# EAGLE design Wio - Expansion Board (EAGLE 9.6.2)
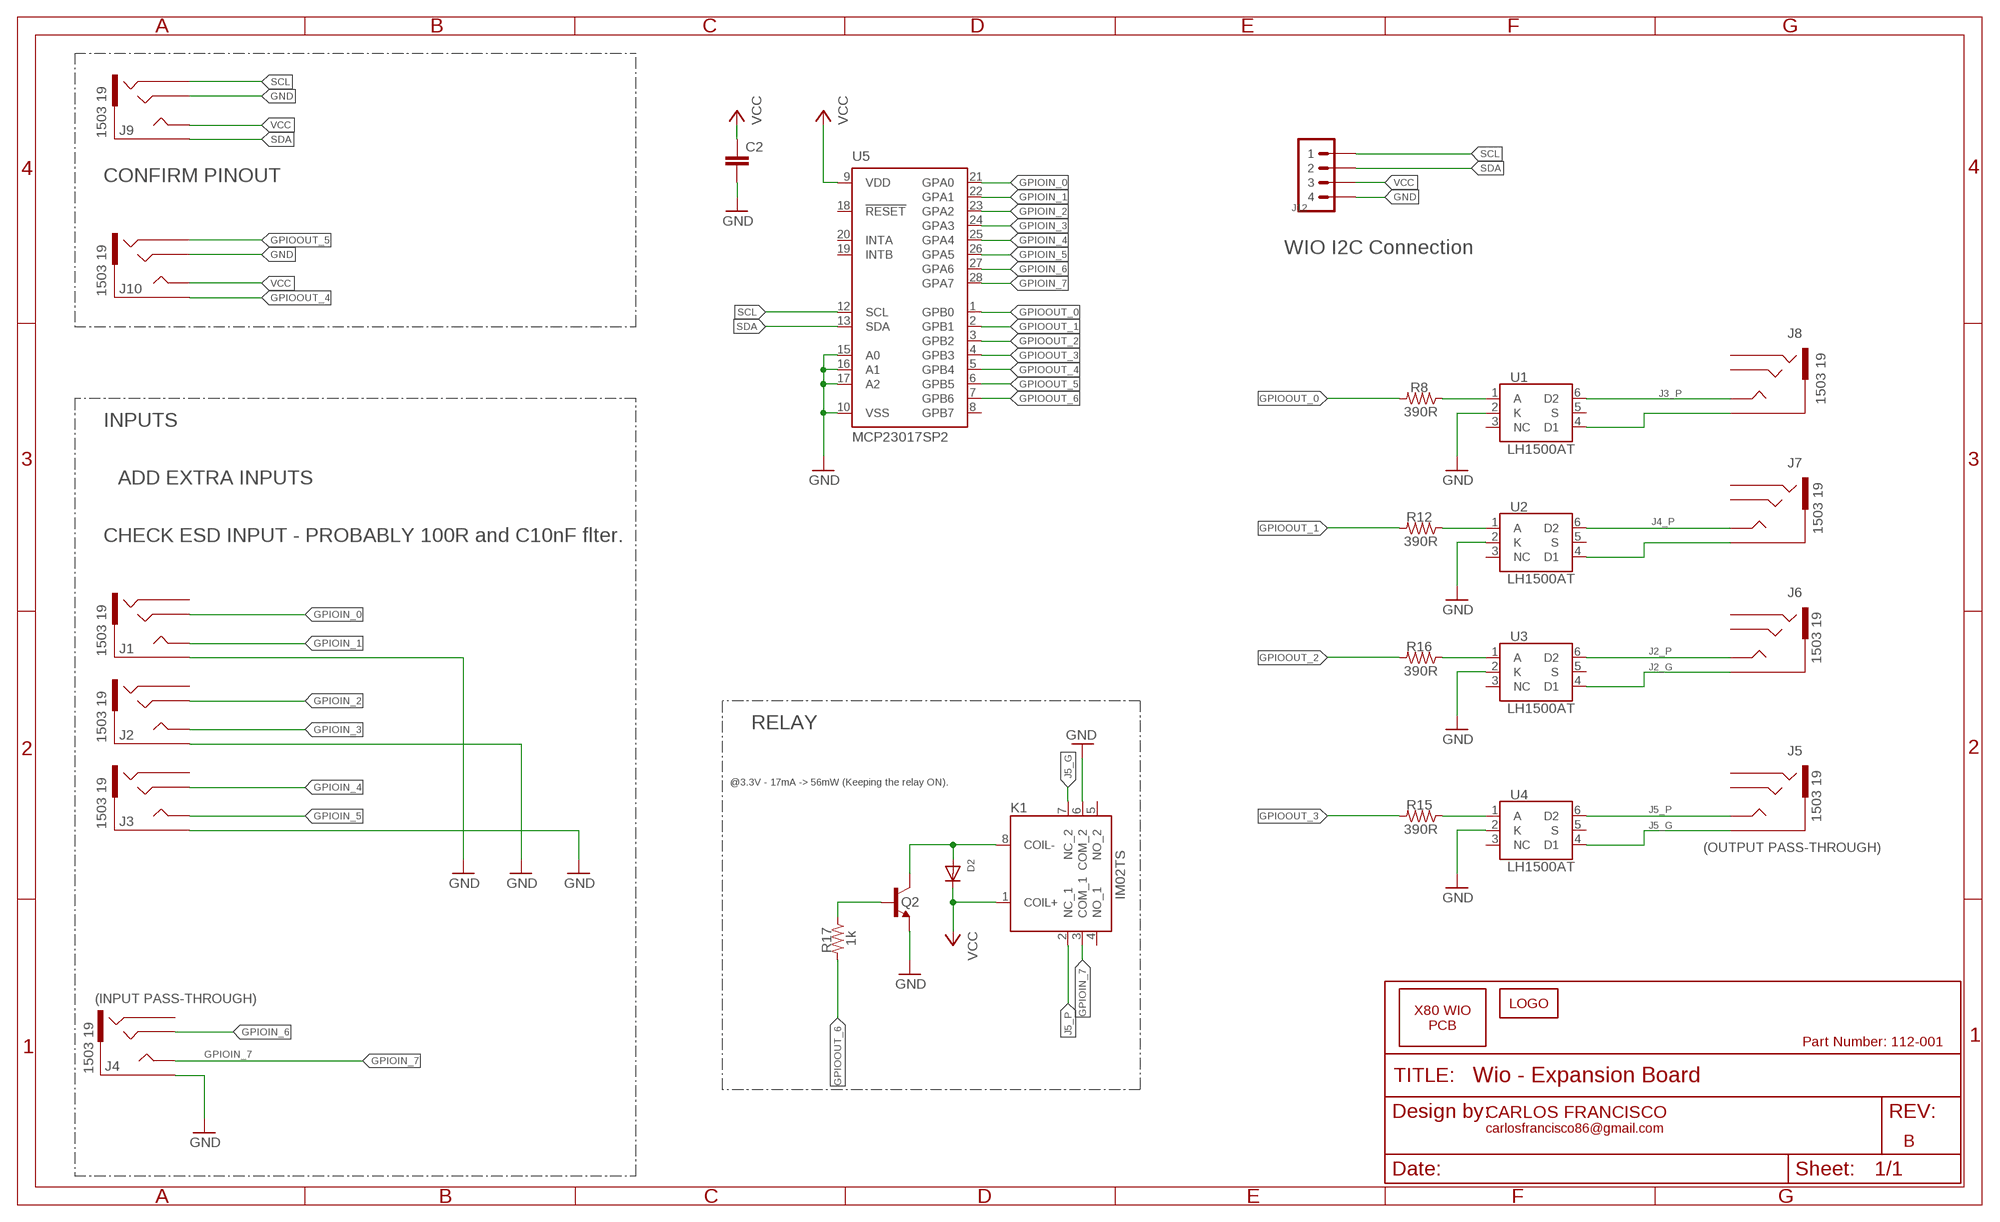
[diagram p0: schematic, sheet 1]

## Parts
C2  C-EU025-025X050  [C025-025X050]
D2  1N4148  DIODE-DO-35  [DO-1N4148]
J1  1503 19  STEREO_JACK-1503-19  [1503-19]
J2  1503 19  STEREO_JACK-1503-19  [1503-19]
J3  1503 19  STEREO_JACK-1503-19  [1503-19]
J4  1503 19  STEREO_JACK-1503-19  [1503-19]
J5  1503 19  STEREO_JACK-1503-19  [1503-19]
J6  1503 19  STEREO_JACK-1503-19  [1503-19]
J7  1503 19  STEREO_JACK-1503-19  [1503-19]
J8  1503 19  STEREO_JACK-1503-19  [1503-19]
J9  1503 19  STEREO_JACK-1503-19  [1503-19]
J10  1503 19  STEREO_JACK-1503-19  [1503-19]
J12  4P-2.0-90D  CONN_04-GROOVE-RA-THT  [HW4-2.0-90D]
K1  IM02TS  IM02TS  [IM03TS114620378]
LOGO1  LOGO-10MM  [LOGO_10MM]
PCB2  X80_WIO_PCB-WIO_PCB_V1  [WIO_PCB]
Q2  PN2222A  NPN-TO-92  [TO92-EBC-OVAL]
R8  390R  R-0206-THT-RS  [0204/7]
R12  390R  R-0206-THT-RS  [0204/7]
R15  390R  R-0206-THT-RS  [0204/7]
R16  390R  R-0206-THT-RS  [0204/7]
R17  1k  R-0206-THT-RS  [0204/7]
U1  LH1500AT  SSR-LH1500AT  [DIP762W47P254L880H410Q6N]
U2  LH1500AT  SSR-LH1500AT  [DIP762W47P254L880H410Q6N]
U3  LH1500AT  SSR-LH1500AT  [DIP762W47P254L880H410Q6N]
U4  LH1500AT  SSR-LH1500AT  [DIP762W47P254L880H410Q6N]
U5  MCP23017SP2  [DIL28-3-ROUND]

## Nets
GND: C2.2 J1.1 J2.1 J3.1 J4.1 J9.3 J10.3 J12.4 K1.6(COM_2) Q2.E U1.2(K) U2.2(K) U3.2(K) U4.2(K) U5.10(VSS) U5.15(A0) U5.16(A1) U5.17(A2)
GPIOIN_0: J1.3 U5.21(GPA0)
GPIOIN_1: J1.4 J1.5 U5.22(GPA1)
GPIOIN_2: J2.3 U5.23(GPA2)
GPIOIN_3: J2.4 J2.5 U5.24(GPA3)
GPIOIN_4: J3.3 U5.25(GPA4)
GPIOIN_5: J3.4 J3.5 U5.26(GPA5)
GPIOIN_6: J4.3 U5.27(GPA6)
GPIOIN_7: J4.4 J4.5 K1.3(COM_1) U5.28(GPA7)
GPIOOUT_0: R8.1 U5.1(GPB0)
GPIOOUT_1: R12.1 U5.2(GPB1)
GPIOOUT_2: R16.1 U5.3(GPB2)
GPIOOUT_3: R15.1 U5.4(GPB3)
GPIOOUT_4: J10.1 U5.5(GPB4)
GPIOOUT_5: J10.2 U5.6(GPB5)
GPIOOUT_6: R17.1 U5.7(GPB6)
J2_G: J6.1 U3.4(D1)
J2_P: J6.4 J6.5 U3.6(D2)
J3_P: J8.4 J8.5 U1.6(D2)
J4_P: J7.4 J7.5 U2.6(D2)
J5_G: J5.1 K1.7(NC_2) U4.4(D1)
J5_P: J5.4 J5.5 K1.2(NC_1) U4.6(D2)
N$2: J8.1 U1.4(D1)
N$3: J7.1 U2.4(D1)
N$6: R8.2 U1.1(A)
N$8: R12.2 U2.1(A)
N$9: R16.2 U3.1(A)
N$10: R15.2 U4.1(A)
N$14: D2.A K1.8(COIL-) Q2.C
N$19: Q2.B R17.2
SCL: J9.2 J12.1 U5.12(SCL)
SDA: J9.1 J12.2 U5.13(SDA)
VCC: C2.1 D2.C J9.4 J9.5 J10.4 J10.5 J12.3 K1.1(COIL+) U5.9(VDD)
Unconnected: J1.2 J2.2 J3.2 J4.2 J5.2 J5.3 J6.2 J6.3 J7.2 J7.3 J8.2 J8.3 K1.4(NO_1) K1.5(NO_2) U1.3(NC) U1.5(S) U2.3(NC) U2.5(S) U3.3(NC) U3.5(S) U4.3(NC) U4.5(S) U5.8(GPB7) U5.18(!RESET) U5.19(INTB) U5.20(INTA)

## Notes on the sheet
- CONFIRM PINOUT
- WIO I2C Connection
- INPUTS
- ADD EXTRA INPUTS
- CHECK ESD INPUT - PROBABLY 100R and C10nF flter.
- RELAY
- @3.3V - 17mA -> 56mW (Keeping the relay ON).
- (OUTPUT PASS-THROUGH)
- (INPUT PASS-THROUGH)
- Part Number: 112-001
- CARLOS FRANCISCO
- carlosfrancisco86@gmail.com
- B

## Library data of the parts
C2 = rcl:C-EU: CAPACITOR, European symbol; SPICEPREFIX: C
D2 = AceCenter:DIODE: General purpose diode; DESCRIPTION: Switching Diode, 400mA 100V, 2-Pin DO-35; MFR: ON Semiconductor; MFR_NUM: 1N4148TR; VENDOR_NUM: 671-5477
J1-J10 = AceCenter:STEREO_JACK: 3.5 mm PCB Mount Stereo Jack Socket; DESCRIPTION: Lumberg 3.5 mm PCB Mount Stereo Jack Socket, 4Pole 1A; MFR: Lumberg; MFR_NUM: 1503 19; VENDOR: RS-ONLINE; VENDOR_NUM: 124-8885
J12 = AceCenter:CONN_04
K1 = AceCenter:IM02TS: DPDT telecom PCB relay, 2A 5Vdc coil, EA Source: Datasheet <http://uk.rs-online.com/web/p/products/4227029>; DESCRIPTION: DPDT telecom PCB relay, 2A 5Vdc coil, EA; MFR: TE Connectivity; MFR_NUM: IM02TS; VENDOR: RS-ONLINE; VENDOR_NUM: 422-7013
LOGO1 = AceCenter:LOGO
PCB2 = AceCenter:X80_WIO_PCB
Q2 = AceCenter:NPN; DESCRIPTION: NPN General-Purpose Amplifier; MFR: ON Semiconductor; MFR_NUM: PN2222ABU; VENDOR: RS-ONLINE; VENDOR_NUM: 739-0555
R8 R12 R15-R17 = AceCenter:R: SMD Resistor
U1-U4 = AceCenter:SSR: Vishay 1 Form A Solid-State Relay (Normally Open); DESCRIPTION: 1 Form A Solid-State Relay (NO); MFR: Vishay; MFR_NUM: LH1500AT; VENDOR: RS-ONLINE; VENDOR_NUM: 180-8794
U5 = AceCenter:MCP23017: http://ww1.microchip.com/downloads/en/DeviceDoc/21952a.pdf Source: http://ww1.microchip.com/downloads/en/DeviceDoc/21952a.pdf

## Board
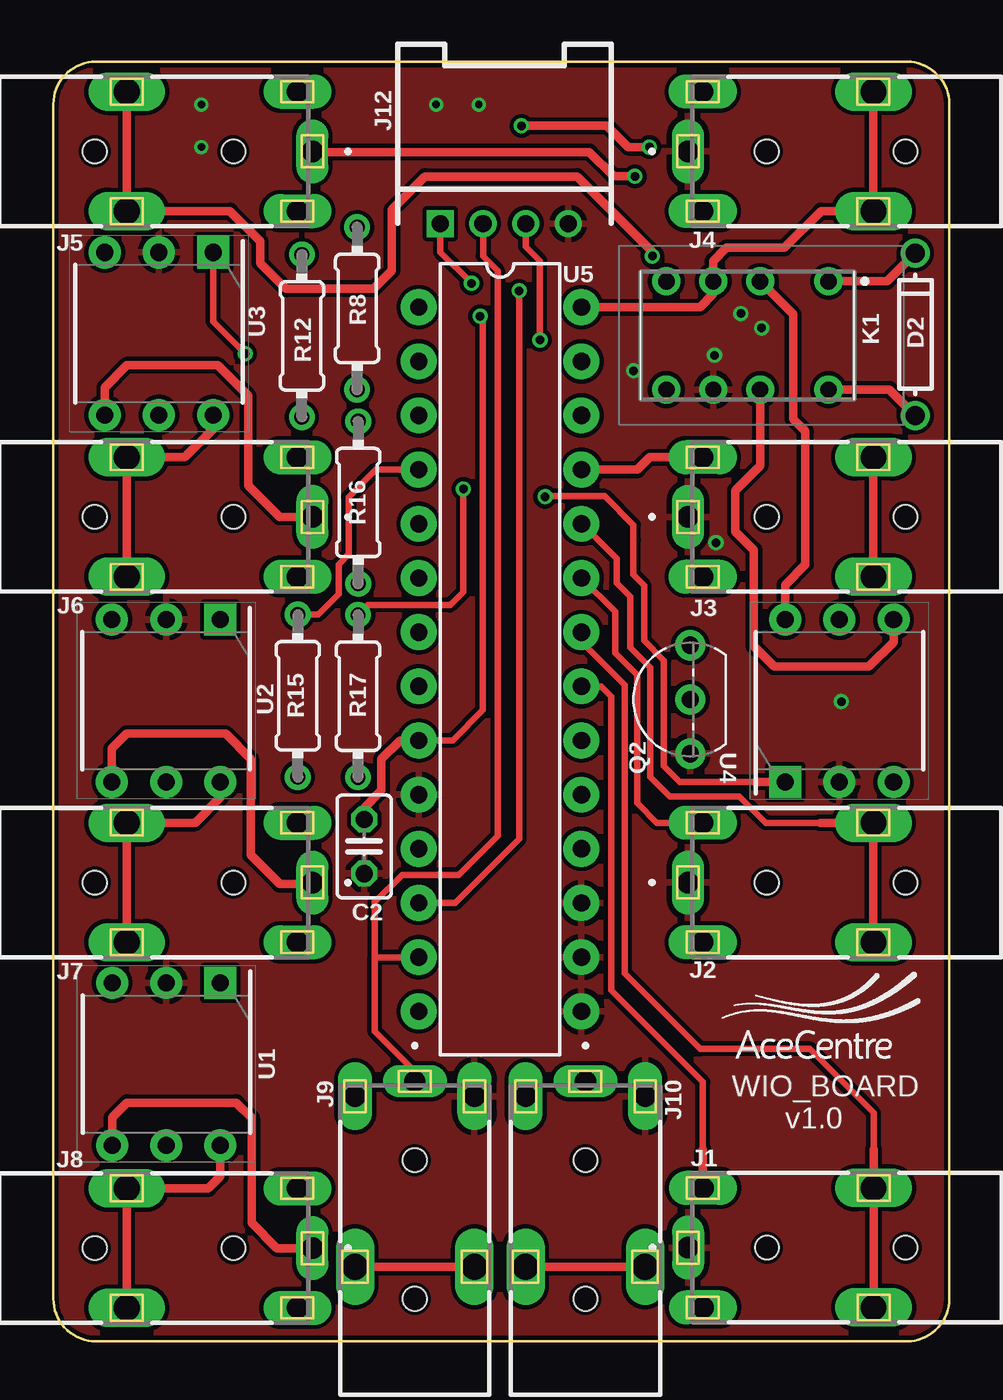
[diagram p1: board, top side]
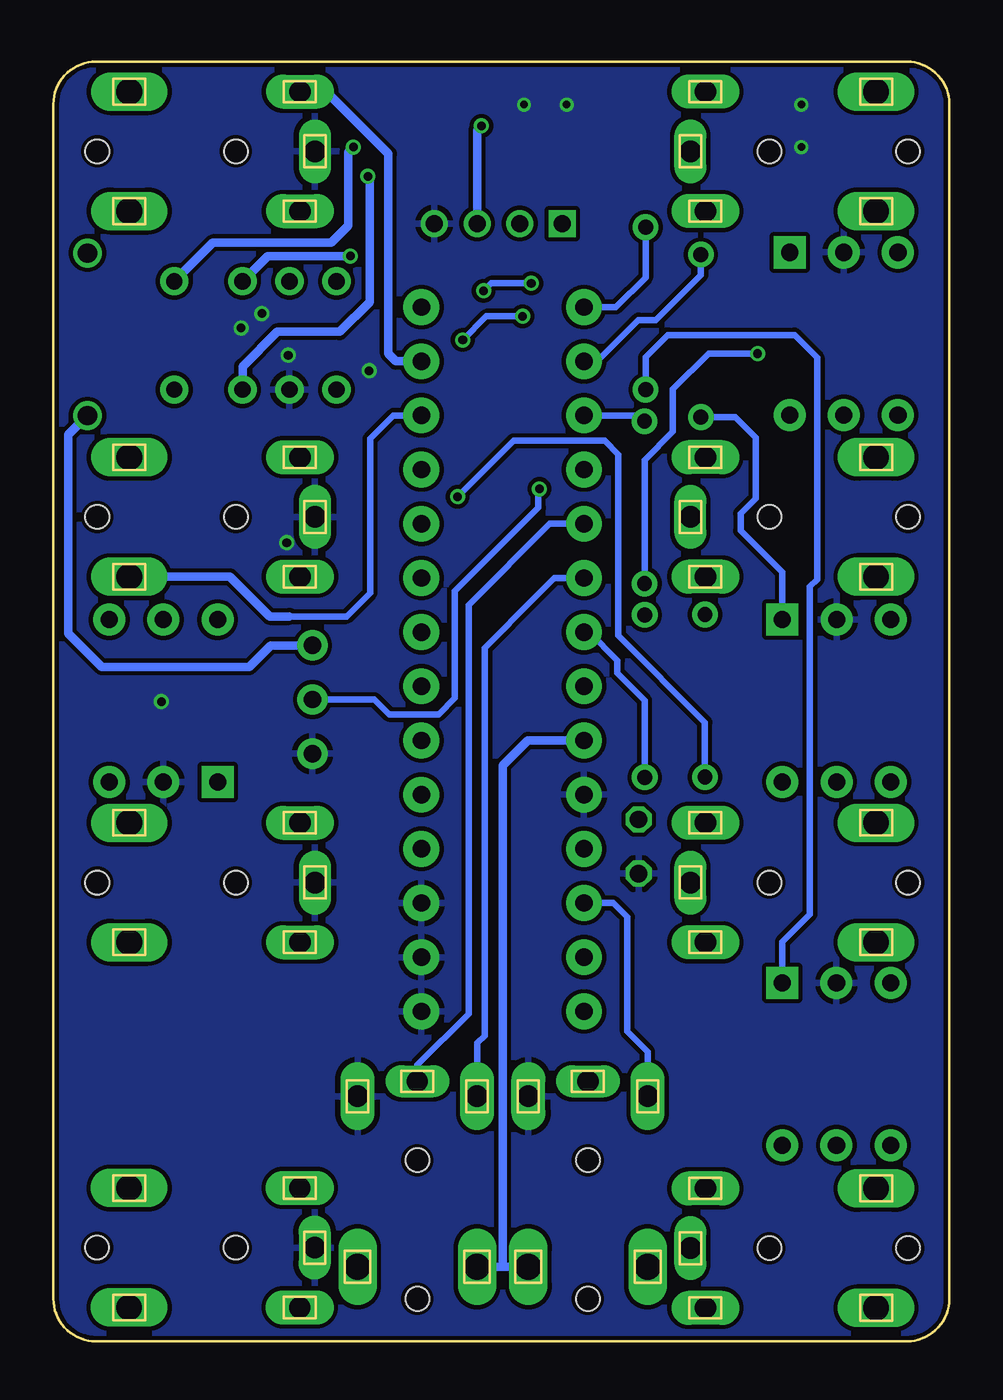
[diagram p2: board, bottom side, seen from below]

Size 42 x 60 mm. Coordinates in mm from the lower left corner, seen from the top.
Copper layers (1*16): Top 0.035mm / dielectric 1.5mm / Bottom 0.035mm
Design rules "SparkFun-2-layer-PCBWay-LIMIT": minimum track width 6mil, minimum drill 0.3mm, track to track 6mil, track to pad 6mil, pad to pad 6mil, via to via 6mil, smd to smd 6mil, copper to edge 6mil, drill to drill 6mil, minimum pad ring 6mil, minimum via ring 6mil, stop-mask expansion 4mil, vias tented up to drill 25mil, thermal gap 10mil

### Footprints (pad centres in the part's own frame; a part is rotated, then mirrored left to right if it is on the bottom)
C025-025X050 = drill 0.813 octagon: 1 -1.27,0; 2 1.27,0
DO-1N4148 = drill 0.9: A -3.81,0; C 3.81,0
1503-19 = drill 1 pad 1.5 long: 1 14.7,0 | drill 1 pad 1.6 long: 2 14,2.8; 3 14,-2.8 | drill 1.2 pad 1.8 long: 4 6,2.8; 5 6,-2.8 | hole 1.1: 4.5,0; 11,0
HW4-2.0-90D = drill 0.8 pad 1.27 square: 1 -3,0 | drill 0.8 pad 1.27: 2 -1,0; 3 1,0; 4 3,0
IM03TS114620378 = drill 0.77 pad 1.32: 1 0,0; 2 3.2,0; 3 5.4,0; 4 7.6,0; 5 7.6,5.08; 6 5.4,5.08; 7 3.2,5.08; 8 0,5.08
TO92-EBC-OVAL = drill 0.813 pad 1.422: B 0,-1.27; C 2.54,-1.27; E -2.54,-1.27
0204/7 = drill 0.7 pad 1.2: 1 -3.81,0; 2 3.81,0
DIP762W47P254L880H410Q6N = drill 0.8 pad 1.5 square: 1 -3.81,2.54 | drill 0.8 pad 1.5: 2 -3.81,0; 3 -3.81,-2.54; 4 3.81,-2.54; 5 3.81,0; 6 3.81,2.54
DIL28-3-ROUND = drill 0.813 pad 1.676: 1 -16.51,-3.81; 2 -13.97,-3.81; 3 -11.43,-3.81; 4 -8.89,-3.81; 5 -6.35,-3.81; 6 -3.81,-3.81; 7 -1.27,-3.81; 8 1.27,-3.81; 9 3.81,-3.81; 10 6.35,-3.81; 11 8.89,-3.81; 12 11.43,-3.81; 13 13.97,-3.81; 14 16.51,-3.81; 15 16.51,3.81; 16 13.97,3.81; 17 11.43,3.81; 18 8.89,3.81; 19 6.35,3.81; 20 3.81,3.81; 21 1.27,3.81; 22 -1.27,3.81; 23 -3.81,3.81; 24 -6.35,3.81; 25 -8.89,3.81; 26 -11.43,3.81; 27 -13.97,3.81; 28 -16.51,3.81

### Placement (x,y rotation side)
C2  14.57,23.2 270 top
D2  40.4,47.22 90 top
J1  44.45,4.39 180 top
J2  44.44,21.51 180 top
J3  44.44,38.65 180 top
J4  44.44,55.79 180 top
J5  -2.56,55.79 0 top
J6  -2.56,38.65 0 top
J7  -2.56,21.51 0 top
J8  -2.56,4.37 0 top
J9  16.94,-2.51 90 top
J10  24.94,-2.51 90 top
J12  21.14,52.41 0 top
K1  36.33,49.7 180 top
LOGO1  31.31,13.19 0 top
PCB2  0,0 0 top
Q2  28.59,30.09 90 top
R8  14.24,48.43 270 top
R12  11.65,47.14 270 top
R15  11.46,30.26 270 top
R16  14.29,39.33 270 top
R17  14.28,30.25 90 top
U1  5.29,13 270 top
U2  5.29,30.04 270 top
U3  4.95,47.25 270 top
U4  36.84,30.03 90 top
U5  20.94,31.98 270 top

### Tracks (layer width: path | path; a pad name or v marks a point on that pad's centre or on a via)
GND  (via drill 0.35, 0.4)
  other vias: 31.06,37.44 27.2,45.51 36.94,29.99 33.2,47.51 30.99,46.23 32.23,48.19 17.94,57.99 19.94,57.99 6.94,57.99 6.94,55.99
  pour Bottom (isolate 0.2): -0.06,57.99 -0.06,-0.32 39.2,-0.32 arc90 42.2,2.68 42.2,57.62 arc90 39.81,60.01 1.96,60.01 arc90
  pour Top (isolate 0.2): 42.2,57.6 42.2,-0.32 1.25,-0.32 arc-90 -0.06,0.99 -0.06,56.99 arc-90 2.99,60.04 39.76,60.04 arc-90
GPIOIN_0
  Top 0.3: 30.45,8.99 30.45,12.16 26.16,16.45 26.16,30.24 25.69,30.71 U5.21
  Top 0.4: J1.3 30.45,8.99
GPIOIN_1
  Top 0.3: 38.45,8.99 38.45,10.71 35.46,13.7 30.32,13.7 26.78,17.24 26.78,30.78 24.75,32.81 U5.22
  Top 0.4: J1.4 J1.5 38.45,8.99
GPIOIN_2
  Top 0.3: U5.23 26.34,34.21 26.34,32.27 27.36,31.24 27.36,25.23 28.28,24.31 J2.3
GPIOIN_3
  Top 0.3: 35.94,24.31 33.39,24.31 32.16,25.54 28.89,25.54 27.98,26.45 27.98,31.6 27.04,32.54 27.04,34.91 26.4,35.55 26.4,36.7 24.77,38.33 U5.24
  Top 0.4: J2.4 J2.5 35.94,24.31
GPIOIN_4
  Top 0.4: U5.25 27.38,40.87 27.96,41.45 J3.3
GPIOIN_5
  Top 0.4: J3.4 J3.5
  Bottom 0.3: 30.94,33.99 28.25,33.99 27.15,35.09 27.15,42.32 26.06,43.41 U5.26
  Bottom 0.4: J3.4 33.72,35.85 31.86,33.99 30.94,33.99
GPIOIN_6
  Bottom 0.4: U5.27 25.94,45.95 26.3,46.31 26.3,55.68 29.21,58.59 J4.3
GPIOIN_7
  Top 0.4: J4.5 J4.4 35.99,52.99 34.27,51.27 31.55,51.27 30.93,50.65 K1.3 30.93,49.11 30.31,48.49 U5.28
GPIOOUT_0
  Bottom 0.3: R8.1 14.24,49.88 15.63,48.49 U5.1
GPIOOUT_1
  Bottom 0.3: R12.1 11.65,49.99 13.76,47.88 14.58,47.88 16.51,45.95 U5.2
GPIOOUT_2
  Bottom 0.3: U5.3 14.56,43.41 R16.1
GPIOOUT_3
  Top 0.3: U5.4 15.12,40.87 13.84,39.59 13.84,36.9 13.37,36.43 13.37,35.03 12.41,34.07 R15.1
GPIOOUT_4
  Bottom 0.3: U5.5 18.73,38.33 22.53,34.53 22.53,15.36 24.94,12.95 J10.1
GPIOOUT_5
  Bottom 0.3: U5.6 18.51,35.79 19.12,35.18 19.41,34.89 21.79,32.51 21.79,14.33 22.14,13.98 J10.2
GPIOOUT_6
  Bottom 0.3: R17.1 14.28,30.05 15.56,31.33 15.56,31.93 16.88,33.25 U5.7
J2_G
  Top 0.4: J6.1 10.61,38.65 9.13,40.13 9.13,44.33 7.7,45.76 3.45,45.76 2.41,44.72 U3.4
J2_P
  Top 0.4: J6.5 J6.4 6.16,41.45 7.49,42.78 U3.6
J3_P
  Top 0.4: J8.5 J8.4 7.27,7.17 7.83,7.73 U1.6
J4_P
  Top 0.4: J7.5 J7.4 6.65,24.31 7.83,25.49 U2.6
J5_G  (via drill 0.4)
  Top 0.4: K1.7 33.13,41.05 31.97,39.89 31.97,37.97 32.83,37.11 32.83,32.59 33.79,31.63 38.23,31.63 39.38,32.78 U4.4 | v27.26,54.62 26.26,54.62 25.12,55.76 12.17,55.76 J5.1
  Bottom 0.4: v27.26,54.62 27.18,54.54 27.18,48.73 28.58,47.33 31.51,47.33 33.13,45.71 K1.7
J5_P  (via drill 0.4)
  Top 0.4: J5.4 J5.5 8.28,52.99 9.69,51.58 9.69,50.56 10.9,49.35 15.01,49.35 15.87,50.21 15.87,53.07 17.41,54.61 24.55,54.61 28.08,51.08 v28.08,50.88 | U4.6 34.3,35.47 35.25,36.42 35.25,42.67 34.68,43.24 34.68,48.15 K1.2
  Bottom 0.4: v28.08,50.88 v28.09,50.89 31.94,50.89 K1.2
N$2
  Top 0.4: U1.4 2.75,10.49 3.45,11.19 8.58,11.19 9.29,10.48 9.29,5.55 10.47,4.37 J8.1
N$3
  Top 0.4: U2.4 2.75,27.8 3.44,28.49 8.07,28.49 9.25,27.31 9.25,22.8 10.61,21.44 12.07,21.44 J7.1
N$6
  Bottom 0.3: U1.1 7.83,18.73 6.54,20.02 6.54,35.38 6.2,35.72 6.2,46.12 7.26,47.18 13.2,47.18 14.24,46.14 R8.2
N$8
  Bottom 0.3: U2.1 7.83,36.06 9.78,38.01 9.78,38.82 9.08,39.52 9.08,42.37 10.04,43.33 R12.2
N$9  (via drill 0.4)
  Top 0.3: U3.1 7.49,48.07 7.49,47.81 v8.99,46.31
  Bottom 0.3: R16.2 14.29,41.32 12.96,42.65 12.96,44.64 11.29,46.31 v8.99,46.31
N$10  (via drill 0.4)
  Top 0.3: 32.94,26.22 29.37,26.22 28.62,26.97 28.62,31.93 27.69,32.86 27.69,35.43 27.17,35.95 27.17,37.56 27.19,37.58 27.19,38.28 25.84,39.63 23.08,39.63 v23.05,39.6
  Top 0.4: U4.1 32.94,26.22
  Bottom 0.3: R15.2 11.46,29.02 15.52,33.08 15.52,41.58 16.16,42.22 20.43,42.22 v23.05,39.6
N$14
  Top 0.4: 37.68,44.62 K1.8 39.18,44.62 D2.A
  Bottom 0.4: Q2.C 31.81,32.63 32.82,31.62 39.72,31.62 41.29,33.19 41.29,42.52 D2.A
N$19  (via drill 0.4)
  Top 0.3: v19.22,39.96 19.22,35.13 18.6,34.51 14.73,34.51 R17.2
  Bottom 0.3: Q2.B 26.95,30.09 26.26,29.4 23.94,29.4 23.18,30.16 23.18,33.99 23.18,34.38 23.18,35.17 19.26,39.09 19.26,39.92 v19.22,39.96
SCL  (via drill 0.4)
  Top 0.3: U5.12 18.83,20.55 21.83,23.55 v21.83,49.26 | J12.1 18.14,51.07 v19.6,49.61
  Bottom 0.3: J9.2 14.14,13.58 15.09,14.53 15.09,19.89 15.75,20.55 U5.12 | v19.6,49.61 21.48,49.61 v21.83,49.26
SDA
  Top 0.3: 16.16,18.01 U5.13 15.07,18.01 | 15.07,18.01 15.07,20.59 16.35,21.87 19.01,21.87 20.83,23.69 20.83,50.19 20.14,50.88 J12.2 | J9.1 16.94,12.65 15.07,14.52 15.07,18.01
VCC  (via drill 0.4)
  Top 0.3: U5.9 18.71,28.17 20.13,29.59 20.13,47.93 v20,48.06 | v22.81,46.95 22.81,50.66 22.14,51.33 J12.3
  Top 0.4: J9.4 J9.5 | J10.4 J10.5 | K1.1 39.08,49.7 D2.C | U5.9 16.25,28.17 15.38,27.3 15.38,25.82 14.57,25.01 C2.1 | v21.94,56.99 25.94,56.99 26.94,55.99 v27.94,55.99
  Bottom 0.3: v20,48.06 21.7,48.06 v22.81,46.95
  Bottom 0.4: J10.4 20.94,3.49 | 20.94,3.49 J9.5 | U5.9 19.76,28.17 20.94,26.99 20.94,3.49 | v27.94,55.99 28.18,55.75 28.18,52.3 28.97,51.51 34.52,51.51 K1.1 | J12.3 22.14,56.79 v21.94,56.99

### Text on the board
tPlace: WIO_BOARD | v1.0